# EAGLE design HapticVibrationShield (EAGLE 6.3)
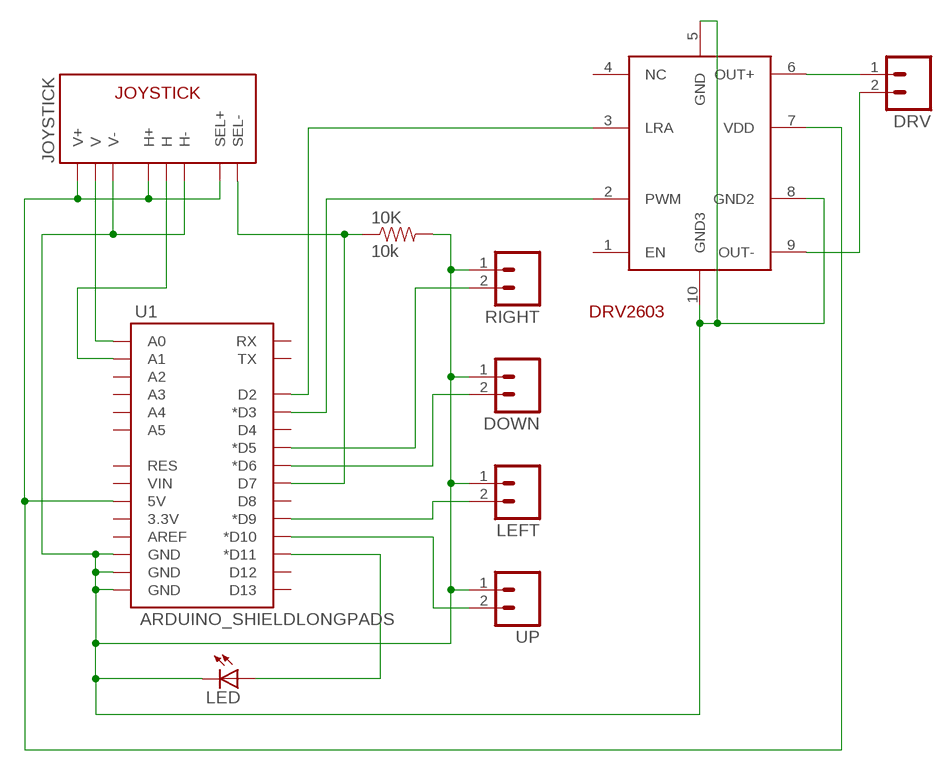
[diagram p0: schematic, sheet 1]

## Parts
10K  10k  RESISTOR2010  [R2010]
DOWN  M02LOCK_LONGPADS  [1X02_LOCK_LONGPADS]
DRV  M02LOCK_LONGPADS  [1X02_LOCK_LONGPADS]
DRV2603  QFN-10QFN-10  [QFN-10]
JOYSTICK  JOYSTICKPTH  [JOYSTICK]
LED  LED5MM  [LED5MM]
LEFT  M02LOCK_LONGPADS  [1X02_LOCK_LONGPADS]
RIGHT  M02LOCK_LONGPADS  [1X02_LOCK_LONGPADS]
U1  ARDUINO_SHIELDLONGPADS  [DUEMILANOVE_SHIELD_LONGPADS]
UP  M02LOCK_LONGPADS  [1X02_LOCK_LONGPADS]

## Nets
GND: 10K.2 DOWN.1 DRV2603.5(GND) DRV2603.8(GND2) DRV2603.10(GND3) JOYSTICK.H3(H-) JOYSTICK.V3(V-) LED.K(C) LEFT.1 RIGHT.1 U1.GND@0(GND) U1.GND@1(GND) U1.GND@2(GND) UP.1
N$1: DOWN.2 U1.D6(*D6)
N$2: LEFT.2 U1.D9(*D9)
N$3: RIGHT.2 U1.D5(*D5)
N$4: U1.D10(*D10) UP.2
N$5: DRV2603.7(VDD) JOYSTICK.B1A(SEL+) JOYSTICK.H1(H+) JOYSTICK.V1(V+) U1.5V
N$6: JOYSTICK.V2(V) U1.A0
N$7: JOYSTICK.H2(H) U1.A1
N$8: 10K.1 JOYSTICK.B2A(SEL-) U1.D7
N$11: LED.A U1.D11(*D11)
N$12: DRV2603.6(OUT+) DRV.1
N$13: DRV2603.9(OUT-) DRV.2
N$14: DRV2603.2(PWM) U1.D3(*D3)
N$15: DRV2603.3(LRA) U1.D2
Unconnected: DRV2603.1(EN) DRV2603.4(NC) U1.3.3V U1.A2 U1.A3 U1.A4 U1.A5 U1.AREF U1.D4 U1.D8 U1.D12 U1.D13 U1.RES U1.RX U1.TX U1.VIN

## Library data of the parts
10K = SparkFun-Passives:RESISTOR: Resistor Basic schematic elements and footprints for 0603, 1206, and PTH resistors.
DOWN DRV LEFT RIGHT UP = SparkFun-Connectors:M02: Header 2 Standard 2-pin 0.1" header. Use with straight break away headers (SKU : PRT-00116), right angle break away headers (PRT-00553), swiss pins (PRT-00743), machine pins (PRT-00117), and female headers (PRT-00115). Molex polarized connector foot print use with SKU : PRT-08233 with associated crimp pins and housings.
DRV2603 = JeffThompson:QFN-10
JOYSTICK = SparkFun-Electromechanical:JOYSTICK: Thumb Joystick Joystick commonly found in PS2 controllers. Two pots and a select switch. Footprint proven. Spark Fun Electronics SKU : COM-09032
LED = SparkFun-LED:LED: LEDs Standard schematic elements and footprints for 5mm, 3mm, 1206, and 0603 sized LEDs. 5mm - Spark Fun Electronics SKU : COM-00529 (and others)
U1 = SparkFun-Boards:ARDUINO_SHIELD: Arduino shield footprint

## Board
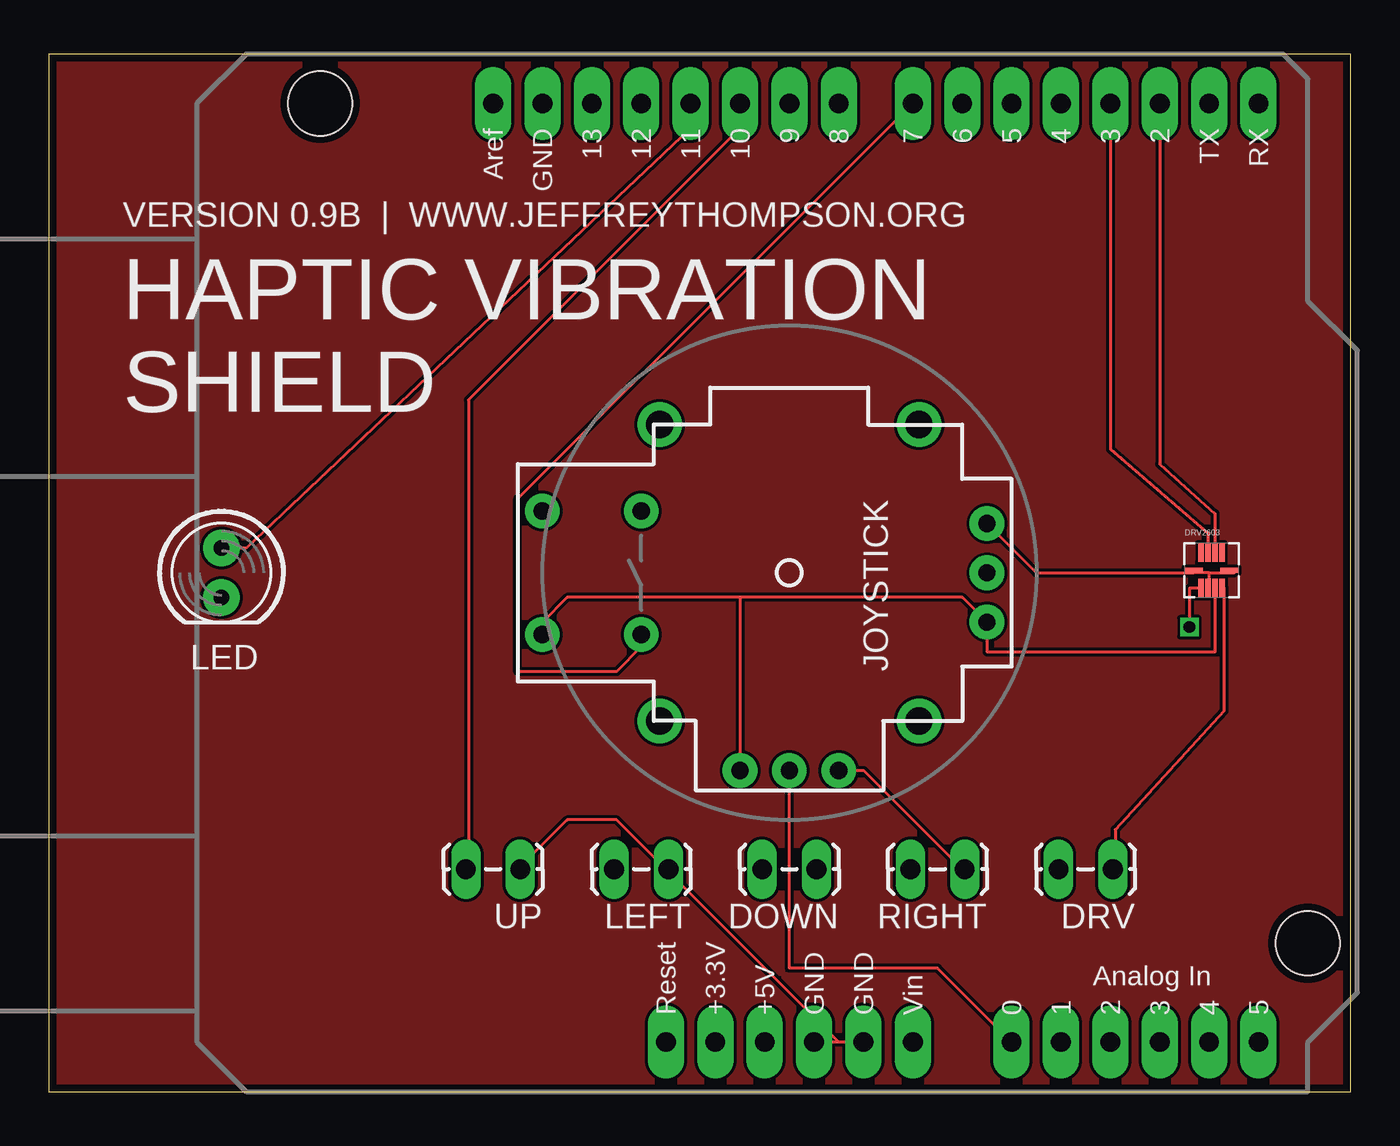
[diagram p1: board, top side]
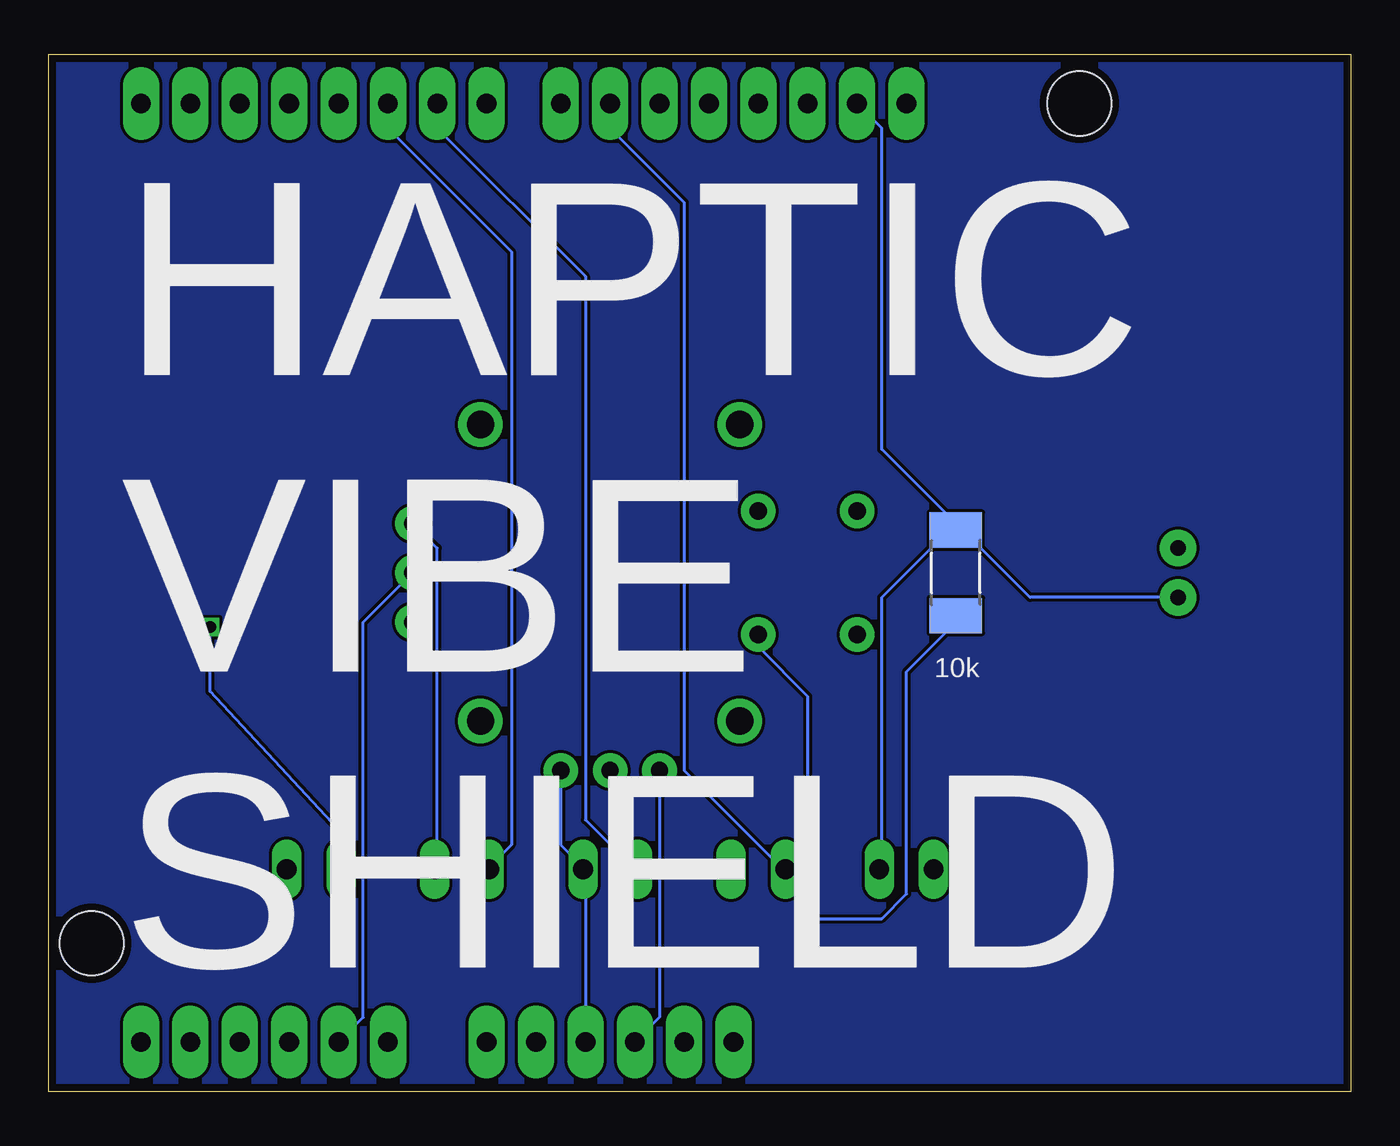
[diagram p2: board, bottom side, seen from below]

Size 66.98 x 53.33 mm. Coordinates in mm from the lower left corner, seen from the top.
Outline: 0,0 66.98,0 66.98,53.33 0,53.33 0,0
Copper layers (1*16): Top 0.0356mm / dielectric 1.5011mm / Bottom 0.0356mm
Design rules "OSHPark": minimum track width 6mil, minimum drill 13mil, track to track 6mil, track to pad 6mil, pad to pad 6mil, via to via 6mil, smd to smd 6mil, copper to edge 15mil, drill to drill 6mil, minimum pad ring 7mil, minimum via ring 7mil, stop-mask expansion 4mil, vias tented up to drill 0mil, thermal gap 10mil

### Footprints (pad centres in the part's own frame; a part is rotated, then mirrored left to right if it is on the bottom)
R2010 = smd 1.8 x 2.7: 1 -2.2,0; 2 2.2,0
1X02_LOCK_LONGPADS = drill 1.016 long: 1 -0.127,0; 2 2.667,0
QFN-10 = smd 0.28 x 0.95: 1 0.85,2.32; 2 1.21,2.32; 3 1.57,2.32; 4 1.93,2.32; 6 1.94,0.48; 7 1.58,0.48; 8 1.22,0.48; 9 0.86,0.48 | smd 0.95 x 0.28: 5 2.32,1.4; 10 0.48,1.4
JOYSTICK = drill 0.9 pad 1.778: B1A -3.175,12.7; B1B 3.175,12.7; B2A -3.175,7.62; B2B 3.175,7.62 | drill 0.889 pad 1.778: H1 -2.54,-10.16; H2 0,-10.16; H3 2.54,-10.16; V1 -10.16,2.54; V2 -10.16,0; V3 -10.16,-2.54 | drill 1.397 pad 2.286: MOUNT1 -7.62,6.668; MOUNT2 -7.62,-6.668; MOUNT3 7.62,-6.668; MOUNT4 7.62,6.668
LED5MM = drill 0.813 pad 1.88: A -1.27,0; K 1.27,0
DUEMILANOVE_SHIELD_LONGPADS = drill 1.016 pad 1.88 long: 3.3V 50.8,26.67; 5V 50.8,29.21; A0 50.8,41.91; A1 50.8,44.45; A2 50.8,46.99; A3 50.8,49.53; A4 50.8,52.07; A5 50.8,54.61; AREF 2.54,15.24; D2 2.54,49.53; D3 2.54,46.99; D4 2.54,44.45; D5 2.54,41.91; D6 2.54,39.37; D7 2.54,36.83; D8 2.54,33.02; D9 2.54,30.48; D10 2.54,27.94; D11 2.54,25.4; D12 2.54,22.86; D13 2.54,20.32; GND@0 50.8,31.75; GND@1 50.8,34.29; GND@2 2.54,17.78; RES 50.8,24.13; RX 2.54,54.61; TX 2.54,52.07; VIN 50.8,36.83 | hole 3.302: 45.72,57.15; 2.54,6.35

### Placement (x,y rotation side)
10K  20.32,26.67 90 bottom
DOWN  39.37,11.43 180 top
DRV  54.61,11.43 180 top
DRV2603  58.42,25.4 0 top
JOYSTICK  38.1,26.67 90 top
LED  8.89,26.67 270 top
LEFT  31.75,11.43 180 top
RIGHT  46.99,11.43 180 top
U1  7.62,53.34 270 top
UP  24.13,11.43 180 top

### Tracks (layer width: path | path; a pad name or v marks a point on that pad's centre or on a via)
GND
  Top 0.152: 58.9,26.67 50.8,26.67 JOYSTICK.H3 | 59.69,26.67 60.96,26.67 DRV2603.5 | 31.75,11.43 29.21,13.97 26.67,13.97 24.13,11.43 UP.1 | U1.GND@1 40.64,2.54 | 40.64,2.54 U1.GND@0 | JOYSTICK.V3 41.91,16.51 46.99,11.43 RIGHT.1 | 40.64,2.54 31.75,11.43 | 31.75,11.43 LEFT.1 | DRV2603.8 59.69,25.88 59.69,26.67 | 59.69,26.67 58.9,26.67 | 58.9,26.67 DRV2603.10
  Bottom 0.152: 20.32,29.21 16.51,25.4 LED.K | U1.GND@2 24.13,49.53 24.13,33.02 20.32,29.21 | 39.37,11.43 40.64,12.7 JOYSTICK.V3 | 39.37,11.43 U1.GND@0 | 39.37,11.43 DOWN.1 | JOYSTICK.H3 46.99,27.94 46.99,11.43 RIGHT.1 | 20.32,29.21 24.13,25.4 24.13,11.43 UP.1 | 20.32,29.21 10K.2
N$1
  Bottom 0.152: U1.D6 46.99,49.53 39.37,41.91 39.37,13.97 36.83,11.43 DOWN.2
N$2
  Bottom 0.152: U1.D9 38.1,49.53 34.29,45.72 34.29,16.51 29.21,11.43 LEFT.2
N$3
  Bottom 0.152: U1.D5 49.53,49.53 43.18,43.18 43.18,12.7 44.45,11.43 RIGHT.2
N$4
  Top 0.152: U1.D10 35.56,49.53 21.59,35.56 21.59,11.43 UP.2
N$5
  Top 0.152: 35.56,25.4 46.99,25.4 JOYSTICK.H1 48.26,22.61 60,22.61 DRV2603.7 | 35.56,25.4 26.67,25.4 25.4,24.13 JOYSTICK.B1A | 35.56,25.4 JOYSTICK.V1
  Bottom 0.152: U1.5V 35.56,3.81 JOYSTICK.V1
N$6
  Top 0.152: JOYSTICK.V2 38.1,6.35 45.72,6.35 U1.A0
N$7
  Bottom 0.152: JOYSTICK.H2 50.8,24.13 50.8,3.81 U1.A1
N$8
  Top 0.152: U1.D7 24.13,30.48 24.13,21.59 29.21,21.59 30.48,22.86 JOYSTICK.B2A
  Bottom 0.152: 10K.1 20.32,24.13 22.86,21.59 22.86,10.16 24.13,8.89 27.94,8.89 27.94,20.32 30.48,22.86 JOYSTICK.B2A
N$9
  pour Bottom: 0,53.34 67.31,53.34 67.31,0 0,0
N$10
  pour Top: 0,53.34 67.31,53.34 67.31,0 0,0
N$11
  Top 0.152: LED.A 10.16,27.94 33.02,49.53 U1.D11
N$12
  Top 0.152: DRV2603.6 60.45,25.88 60.45,19.56 54.86,13.46 54.86,11.43 DRV.1
N$13  (via drill 0.6)
  Top 0.152: DRV2603.9 58.67,25.88 v58.67,23.88
  Bottom 0.152: DRV.2 52.07,11.43 52.07,13.46 58.67,20.57 v58.67,23.88
N$14
  Top 0.152: U1.D3 54.61,33.02 59.63,28.7 DRV2603.2
N$15
  Top 0.152: U1.D2 57.15,32.26 59.99,29.72 DRV2603.3

### Text on the board
_tsilk: VERSION 0.9B | WWW.JEFFREYTHOMPSON.ORG | HAPTIC VIBRATION / SHIELD
_bsilk: 10k | HAPTIC / VIBE / SHIELD